# EAGLE schematic tw_project_starter_template (EAGLE 9.6.2)
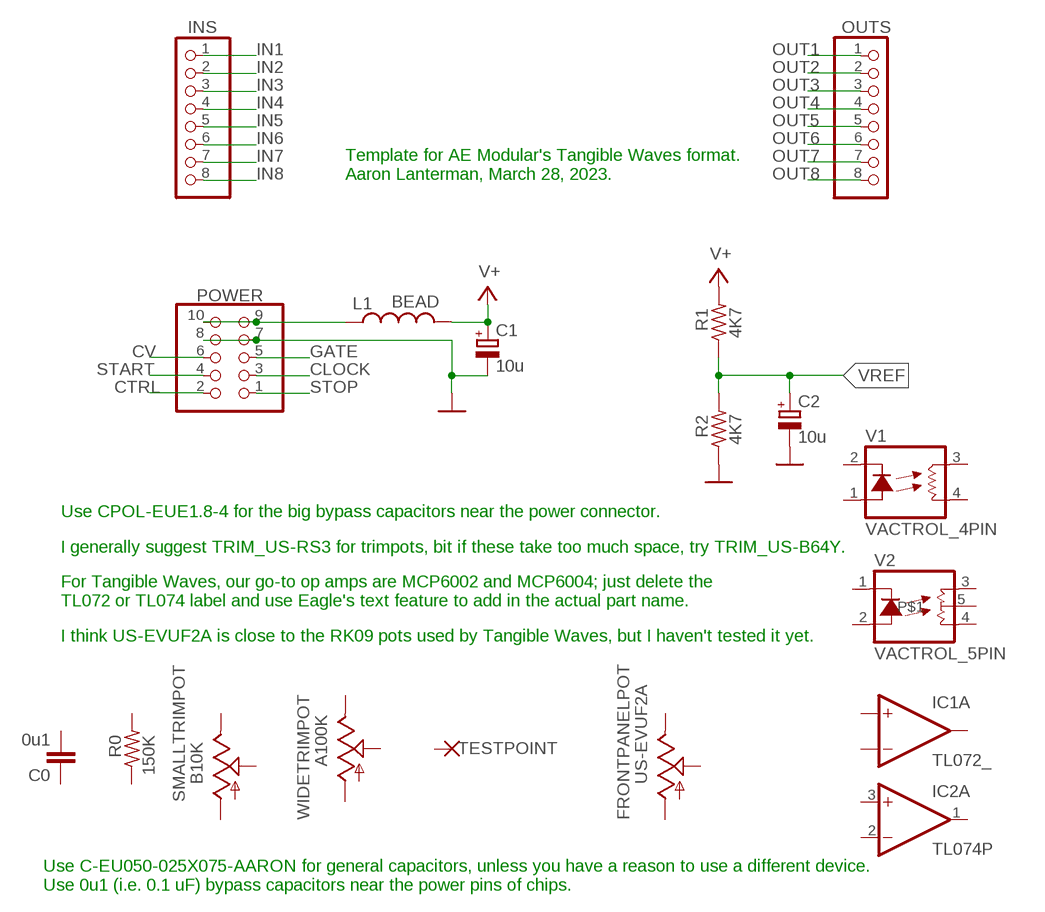
[diagram p0: schematic, sheet 1]

## Parts
C0  0u1  C-EU050-025X075-AARON  [C050-025X075-AARON]
C1  10u  CPOL-EUE1.8-4  [E1,8-4]
C2  10u  CPOL-EUE1.8-4  [E1,8-4]
FRONTPANELPOT  US-EVUF2A  [EVUF]
IC1  TL072_  [DIL08]
IC2  TL074P  [DIL14]
INS  PINHD-1X8  [1X08]
L1  BEAD  L-US0207/10  [0207/10]
OUTS  PINHD-1X8  [1X08]
POWER  PINHD-2X5  [2X05]
R0  150K  R-US_0207/10  [0207/10]
R1  4K7  R-US_0207/10  [0207/10]
R2  4K7  R-US_0207/10  [0207/10]
SMALLTRIMPOT  B10K  TRIM_US-B64Y  [B64Y]
TESTPOINT  IOPAD_AARON  [ELLIPTICALPADSINGLE]
V1  VACTROL_4PIN  [VACTROL_4PIN_VTL5C]
V2  VACTROL_5PIN  [VACTROL_5PIN_VTL5C-2]
WIDETRIMPOT  A100K  TRIM_US-S63P  [S63P]

## Nets
+5V: L1.1 POWER.9 POWER.10
CLOCK: POWER.3
CTRL: POWER.2
CV: POWER.6
GATE: POWER.5
GND: C1.- C2.- POWER.7 POWER.8 R2.1
IN1: INS.1
IN2: INS.2
IN3: INS.3
IN4: INS.4
IN5: INS.5
IN6: INS.6
IN7: INS.7
IN8: INS.8
OUT1: OUTS.1
OUT2: OUTS.2
OUT3: OUTS.3
OUT4: OUTS.4
OUT5: OUTS.5
OUT6: OUTS.6
OUT7: OUTS.7
OUT8: OUTS.8
START: POWER.4
STOP: POWER.1
V+: C1.+ L1.2 R1.2
VREF: C2.+ R1.1 R2.2
Unconnected: C0.1 C0.2 FRONTPANELPOT.1(A) FRONTPANELPOT.2(S) FRONTPANELPOT.3(E) IC1.1(A:OUT) IC1.2(A:-IN) IC1.3(A:+IN) IC1.5(B:+IN) IC1.6(B:-IN) IC1.7(B:OUT) IC2.1(A:OUT) IC2.2(A:-IN) IC2.3(A:+IN) IC2.5(B:+IN) IC2.6(B:-IN) IC2.7(B:OUT) IC2.8(C:OUT) IC2.9(C:-IN) IC2.10(C:+IN) IC2.12(D:+IN) IC2.13(D:-IN) IC2.14(D:OUT) R0.1 R0.2 SMALLTRIMPOT.A SMALLTRIMPOT.E SMALLTRIMPOT.S TESTPOINT.P$1(P) V1.1(LED-) V1.2(LED+) V1.3(RES1) V1.4(RES2) V2.1(A) V2.2(C) V2.3(L1) V2.4(L2) V2.5 WIDETRIMPOT.A WIDETRIMPOT.E WIDETRIMPOT.S

## Notes on the sheet
- Template for AE Modular's Tangible Waves format.
  Aaron Lanterman, March 28, 2023.
- Use CPOL-EUE1.8-4 for the big bypass capacitors near the power connector.
- I generally suggest TRIM_US-RS3 for trimpots, bit if these take too much space, try TRIM_US-B64Y.
- For Tangible Waves, our go-to op amps are MCP6002 and MCP6004; just delete the
  TL072 or TL074 label and use Eagle's text feature to add in the actual part name.
- I think US-EVUF2A is close to the RK09 pots used by Tangible Waves, but I haven't tested it yet.
- Use C-EU050-025X075-AARON for general capacitors, unless you have a reason to use a different device.
  Use 0u1 (i.e. 0.1 uF) bypass capacitors near the power pins of chips.

## Power pins joined to a net without a drawn wire
V+: IC1.8(P:V+) IC2.4(P:V+)
V-: IC1.4(P:V-) IC2.11(P:V-)

## Library data of the parts
C0 = aaroncaps:C-EU: CAPACITOR, European symbol
C1 C2 = rcl:CPOL-EU: POLARIZED CAPACITOR, European symbol
FRONTPANELPOT = pot:US-EVU: 9 mm Square Rotary Potentiometers Source: Panasonic
IC1 = MusicThingModular:TL072: Generic Dual Op Amp
IC2 = linear:TL074: OP AMP
INS OUTS = pinhead:PINHD-1X8: PIN HEADER
L1 = rcl:L-US: INDUCTOR, American symbol; SPICEPREFIX: L
POWER = pinhead:PINHD-2X5: PIN HEADER
R0 R1 R2 = rcl:R-US_: RESISTOR, American symbol
SMALLTRIMPOT WIDETRIMPOT = pot:TRIM_US-: POTENTIOMETER
TESTPOINT = aaronlibrary:IOPAD_AARON
V1 = MusicThingModular:VACTROL_4PIN: 4 Pin Vactrol Resistive Photocoupler
V2 = MusicThingModular:VACTROL_5PIN: 5 Pin Vactrol Dual Resistive Photocoupler